# Altium schematic sheet GSMPart.SchDoc
size A
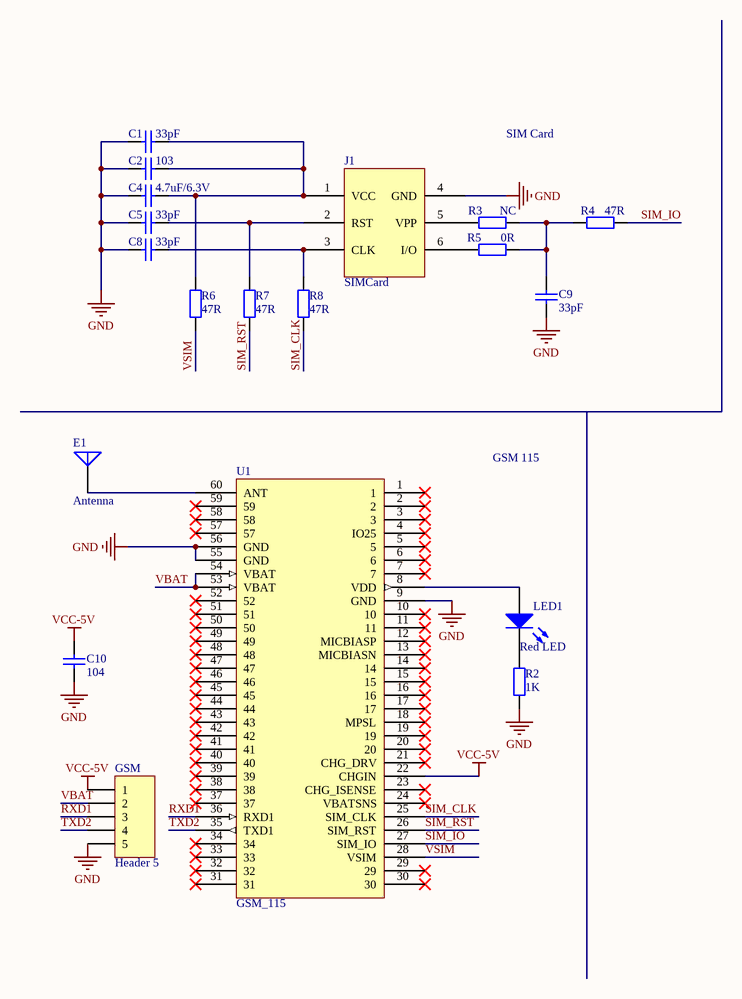
[diagram p0: GSMPart.SchDoc]

## Parts
C1  value 33pF  [1608[0603]]  (hidden comment: Cap)
C2  value 103  [1608[0603]]  (hidden comment: Cap)
C4  value 4.7uF/6.3V  [1608[0603]]  (hidden comment: Cap)
C5  value 33pF  [1608[0603]]  (hidden comment: Cap)
C8  value 33pF  [1608[0603]]  (hidden comment: Cap)
C9  value 33pF  [1608[0603]]  (hidden comment: Cap)
C10  value 104  [1608[0603]]  (hidden comment: Cap)
E1  Antenna  [PIN1]
GSM  Header 5  [HDR1X5]
J1  SIMCard  [PCB_SIM]
LED1  Red LED  [1608[0603] - POL]
R2  value 1K  [1608[0603]]  (hidden comment: RES)
R3  value NC  [1608[0603]]  (hidden comment: RES)
R4  value 47R  [1608[0603]]  (hidden comment: RES)
R5  value 0R  [1608[0603]]  (hidden comment: RES)
R6  value 47R  [1608[0603]]  (hidden comment: RES)
R7  value 47R  [1608[0603]]  (hidden comment: RES)
R8  value 47R  [1608[0603]]  (hidden comment: RES)
U1  GSM_115

## Nets
GND: C1.1 C2.1 C4.1 C5.1 C8.1 C9.1 C10.1 GSM.5 J1.4(GND) R2.1 U1.9(GND) U1.55(GND) U1.56(GND)
VCC-5V: C10.2 GSM.1 U1.22(CHGIN)
RXD1: GSM.3 U1.36(RXD1)
SIM_CLK: R8.1 U1.25(SIM_CLK)
SIM_IO: R4.2 U1.27(SIM_IO)
SIM_RST: R7.1 U1.26(SIM_RST)
TXD2: GSM.4 U1.35(TXD1)
VBAT: GSM.2 U1.53(VBAT) U1.54(VBAT)
VSIM: R6.1 U1.28(VSIM)
NetC1_2: C1.2 C2.2 C4.2 J1.1(VCC) R6.2
NetC5_2: C5.2 J1.2(RST) R7.2
NetC8_2: C8.2 J1.3(CLK) R8.2
NetC9_2: C9.2 R3.2 R4.1 R5.2
NetE1_1: E1.1(A) U1.60(ANT)
NetJ1_5: J1.5(VPP) R3.1
NetJ1_6: J1.6(I/O) R5.1
NetLED1_1: LED1.1(A) U1.8(VDD)
NetLED1_2: LED1.2(K) R2.2

Not connected (* = marked no-connect by the designer): U1 1* 2* 3* 4(IO25)* 5* 6* 7* 10* 11* 12(MICBIASP)* 13(MICBIASN)* 14* 15* 16* 17* 18(MPSL)* 19* 20* 21(CHG_DRV)* 23(CHG_ISENSE)* 24(VBATSNS)* 29* 30* 31* 32* 33* 34* 37* 38* 39* 40* 41* 42* 43* 44* 45* 46* 47* 48* 49* 50* 51* 52* 57* 58* 59*

## Notes on the sheet
- SIM Card
- GSM 115

## Library data of the parts
C1 C2 C4 C5 C8-C10 = Cap: Capacitor; Published: 8-Jun-2000; LatestRevisionDate: 17-Jul-2002; LatestRevisionNote: Re-released for DXP Platform.; Publisher: Altium Limited
E1 = Antenna: Generic Antenna; Published: 24-Mar-1999; LatestRevisionDate: 17-Jul-2002; LatestRevisionNote: Re-released for DXP Platform.; PackageReference: PIN1; Publisher: Altium Limited
GSM = Header 5: Header, 5-Pin; LatestRevisionDate: 17-Jul-2002; LatestRevisionNote: Re-released for DXP Platform.; Publisher: Altium Limited
J1 = SIMCard: Sim Card
LED1 = LED
R2-R8 = RES: Resistor; Published: 8-Jun-2000; LatestRevisionDate: 17-Jul-2002; LatestRevisionNote: Re-released for DXP Platform.; Publisher: Altium Limited
U1 = GSM115